# EasyEDA schematic SCH_时钟_2022-10-18.json
TITLE: Sheet_1; REV: 1.0; Date: 2022-10-18; Sheet: 1/1; Drawn By: 小周; Company: Your Company
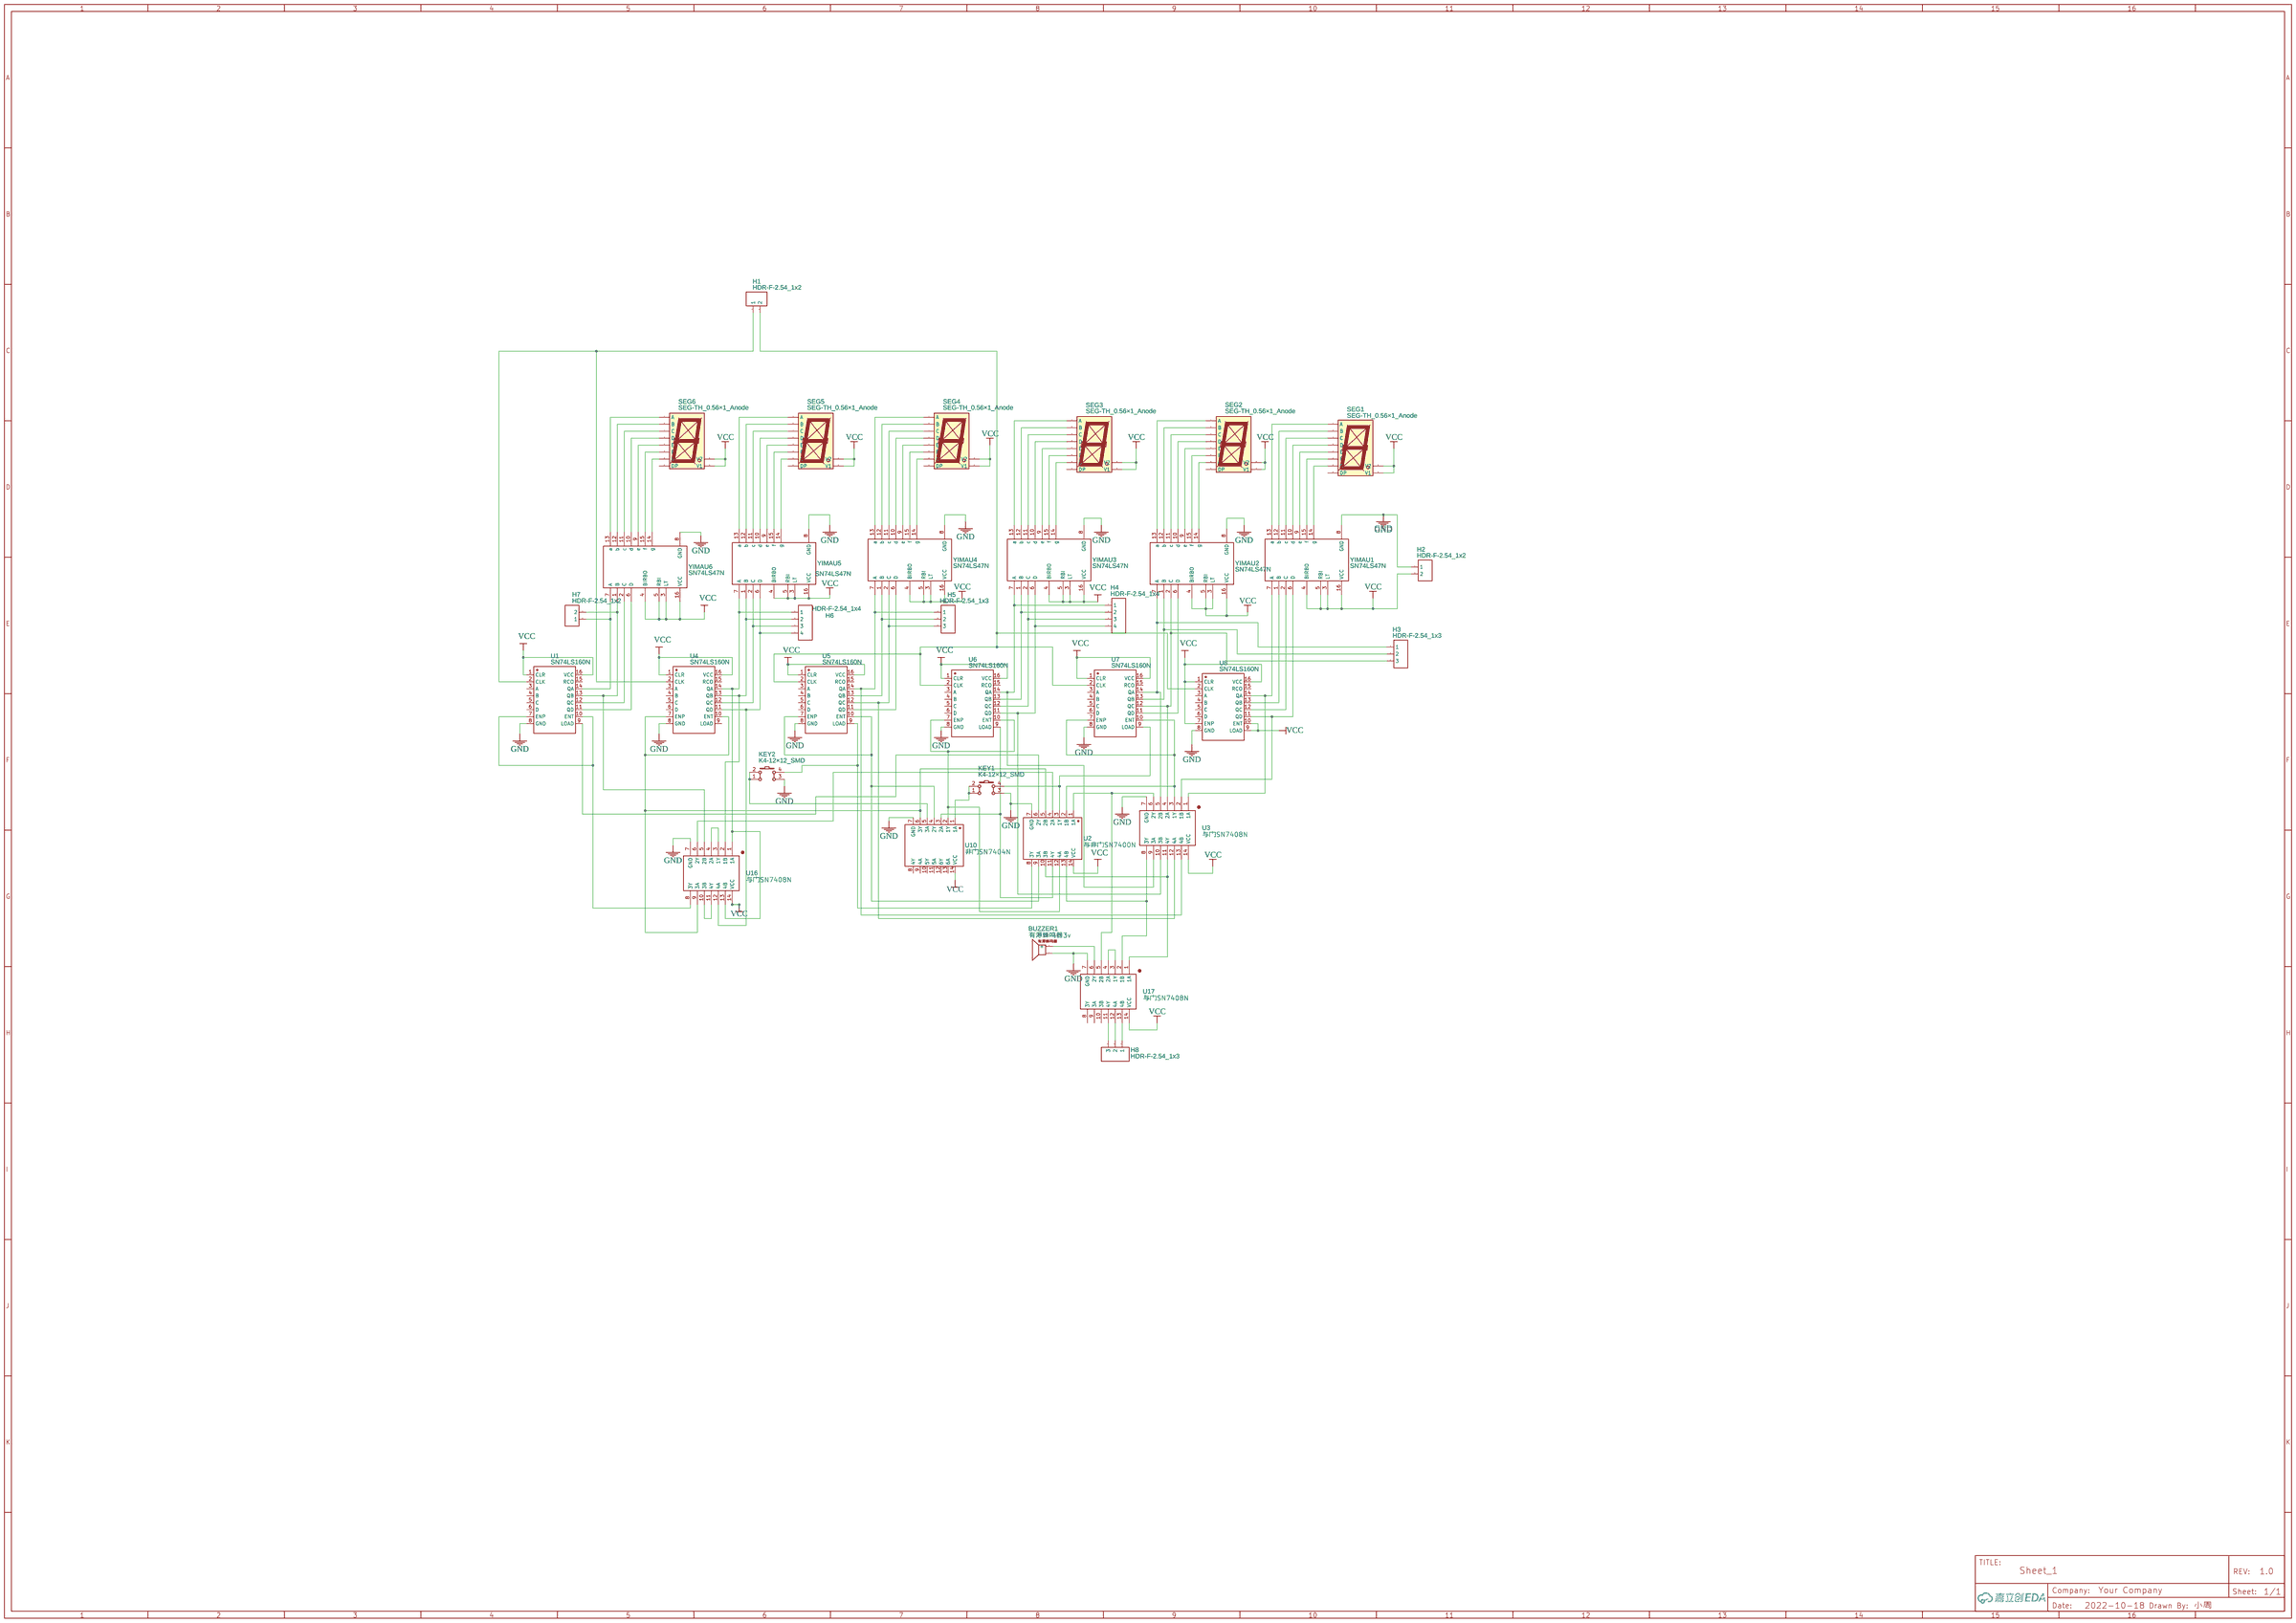
[diagram p0: schematic sheet]

## Parts
BUZZER1  有源蜂鸣器3v  [有源蜂鸣器3V]
H1  HDR-F-2.54_1x2  [HDR-F-2.54_1X2]
H2  HDR-F-2.54_1x2  [HDR-F-2.54_1X2]
H3  HDR-F-2.54_1x3  [HDR-F-2.54_1X3]
H4  HDR-F-2.54_1x4  [HDR-F-2.54_1X4]
H5  HDR-F-2.54_1x3  [HDR-F-2.54_1X3]
H6  HDR-F-2.54_1x4  [HDR-F-2.54_1X4]
H7  HDR-F-2.54_1x2  [HDR-F-2.54_1X2]
H8  HDR-F-2.54_1x3  [HDR-F-2.54_1X3]
KEY1  K4-12×12_SMD  [KEY-SMD_4P-L12.0-W12.0-P5.00-LS15.2]
KEY2  K4-12×12_SMD  [KEY-SMD_4P-L12.0-W12.0-P5.00-LS15.2]
SEG1  SEG-TH_0.56×1_Anode  [LED-SEG-TH_10P-L12.6-W19.0-P2.54-S15.24-BL]
SEG2  SEG-TH_0.56×1_Anode  [LED-SEG-TH_10P-L12.6-W19.0-P2.54-S15.24-BL]
SEG3  SEG-TH_0.56×1_Anode  [LED-SEG-TH_10P-L12.6-W19.0-P2.54-S15.24-BL]
SEG4  SEG-TH_0.56×1_Anode  [LED-SEG-TH_10P-L12.6-W19.0-P2.54-S15.24-BL]
SEG5  SEG-TH_0.56×1_Anode  [LED-SEG-TH_10P-L12.6-W19.0-P2.54-S15.24-BL]
SEG6  SEG-TH_0.56×1_Anode  [LED-SEG-TH_10P-L12.6-W19.0-P2.54-S15.24-BL]
U1  SN74LS160N  [DIP-16]
U2  与非门SN7400N  [DIP14]
U3  与门SN7408N  [DIP14]
U4  SN74LS160N  [DIP-16]
U5  SN74LS160N  [DIP-16]
U6  SN74LS160N  [DIP-16]
U7  SN74LS160N  [DIP-16]
U8  SN74LS160N  [DIP-16]
U10  非门SN7404N  [DIP14]
U16  与门SN7408N  [DIP14]
U17  与门SN7408N  [DIP14]
YIMAU1  SN74LS47N  [DIP-16]
YIMAU2  SN74LS47N  [DIP-16]
YIMAU3  SN74LS47N  [DIP-16]
YIMAU4  SN74LS47N  [DIP-16]
YIMAU5  SN74LS47N  [DIP-16]
YIMAU6  SN74LS47N  [DIP-16]

## Library data of the parts
BUZZER1 = 有源蜂鸣器3v: Supplier: LCSC; Manufacturer: HNDZ; Manufacturer Part: TMB12A12; Supplier Part: C96079; Contributor: yibeikele
H1 H2 H7 = HDR-F-2.54_1x2: Supplier Part: C49661; Supplier: LCSC; Contributor: LCEDA_Lib
H3 H5 H8 = HDR-F-2.54_1x3: Supplier Part: C146690; Supplier: LCSC; Contributor: LCEDA_Lib
H4 H6 = HDR-F-2.54_1x4: Supplier Part: C225501; Supplier: LCSC; Contributor: LCEDA_Lib
KEY1 KEY2 = K4-12×12_SMD: Supplier Part: C136697; Supplier: LCSC; Manufacturer: 韩国韩荣; Manufacturer Part: K2-1103SP-E4SW-04; Contributor: LCEDA_Lib
SEG1-SEG6 = SEG-TH_0.56×1_Anode: Manufacturer: 志浩; Supplier Part: C8092; Supplier: LCSC; Contributor: LCEDA_01
U1 U4-U8 = SN74LS160N: Supplier: LCSC; Supplier Part: C113834; Manufacturer: YAGEO; Manufacturer Part: CC0805JRNPO9BN821; Contributor: LCSC
U2 = SN7400N: Contributor: sky1001
U3 U16 U17 = SN7408N: Contributor: cdea
U10 = SN7404N
YIMAU1-YIMAU6 = -: Supplier: LCSC; Manufacturer: TI; Contributor: LCSC; Supplier Part: C129379

## Nets
GND: BUZZER1.- H2.1 KEY1.3 KEY2.3 U1.8(GND) U2.7(GND) U3.7(GND) U4.8(GND) U5.8(GND) U6.8(GND) U7.8(GND) U8.8(GND) U10.7(GND) U16.7(GND) U17.7(GND) YIMAU1.8(GND) YIMAU2.8(GND) YIMAU3.8(GND) YIMAU4.8(GND) YIMAU5.8(GND) YIMAU6.8(GND)
VCC: H2.2 SEG1.3(V1) SEG1.8(V2) SEG2.3(V1) SEG2.8(V2) SEG3.3(V1) SEG3.8(V2) SEG4.3(V1) SEG4.8(V2) SEG5.3(V1) SEG5.8(V2) SEG6.3(V1) SEG6.8(V2) U1.1(CLR) U1.16(VCC) U2.14(VCC) U3.14(VCC) U4.1(CLR) U4.16(VCC) U5.1(CLR) U5.16(VCC) U6.1(CLR) U6.16(VCC) U7.1(CLR) U7.16(VCC) U8.1(CLR) U8.7(ENP) U8.9(LOAD) U8.10(ENT) U8.16(VCC) U10.14(VCC) U16.14(VCC) U17.14(VCC) YIMAU1.3(LT) YIMAU1.4(BIRBO) YIMAU1.5(RBI) YIMAU1.16(VCC) YIMAU2.3(LT) YIMAU2.4(BIRBO) YIMAU2.5(RBI) YIMAU2.16(VCC) YIMAU3.3(LT) YIMAU3.4(BIRBO) YIMAU3.5(RBI) YIMAU3.16(VCC) YIMAU4.3(LT) YIMAU4.4(BIRBO) YIMAU4.5(RBI) YIMAU4.16(VCC) YIMAU5.3(LT) YIMAU5.4(BIRBO) YIMAU5.5(RBI) YIMAU5.16(VCC) YIMAU6.3(LT) YIMAU6.4(BIRBO) YIMAU6.5(RBI) YIMAU6.16(VCC)
Net-(BUZZER1-+): BUZZER1.+ U17.6(2Y)
Net-(H1-1): H1.1 U1.2(CLK) U4.2(CLK)
Net-(H1-2): H1.2 U5.2(CLK) U6.2(CLK) U7.2(CLK) U8.2(CLK)
Net-(H3-1): H3.1 U3.5(2B) U7.14(QA) YIMAU2.7(A)
Net-(H3-2): H3.2 U7.13(QB) YIMAU2.1(B)
Net-(H3-3): H3.3 U3.4(2A) U7.12(QC) YIMAU2.2(C)
Net-(H4-1): H4.1 U3.9(3A) U6.14(QA) YIMAU3.7(A)
Net-(H4-2): H4.2 U6.13(QB) YIMAU3.1(B)
Net-(H4-3): H4.3 U6.12(QC) YIMAU3.2(C)
Net-(H4-4): H4.4 U3.10(3B) U6.11(QD) YIMAU3.6(D)
Net-(H5-1): H5.1 U3.13(4B) U5.14(QA) YIMAU4.7(A)
Net-(H5-2): H5.2 U5.13(QB) YIMAU4.1(B)
Net-(H5-3): H5.3 U3.12(4A) U5.12(QC) YIMAU4.2(C)
Net-(H6-1): H6.1 U4.14(QA) U16.1(1A) U16.13(4B) YIMAU5.7(A)
Net-(H6-2): H6.2 U4.13(QB) U16.2(1B) YIMAU5.1(B)
Net-(H6-3): H6.3 U4.12(QC) YIMAU5.2(C)
Net-(H6-4): H6.4 U4.11(QD) U16.12(4A) YIMAU5.6(D)
Net-(H7-1): H7.1 U1.14(QA) YIMAU6.7(A)
Net-(H7-2): H7.2 U1.13(QB) U16.5(2B) YIMAU6.1(B)
Net-(H8-1): H8.1 U17.13(4B)
Net-(H8-2): H8.2 U17.12(4A)
Net-(H8-3): H8.3 U17.11(4Y)
Net-(KEY1-1): KEY1.1 KEY1.2 U10.1(1A)
Net-(KEY1-4): KEY1.4 U2.3(1Y) U7.9(LOAD)
Net-(KEY2-1): KEY2.1 KEY2.2 U10.5(3A)
Net-(KEY2-4): KEY2.4 U2.8(3Y) U5.9(LOAD)
Net-(SEG1-1): SEG1.1(E) YIMAU1.9(e)
Net-(SEG1-2): SEG1.2(D) YIMAU1.10(d)
Net-(SEG1-4): SEG1.4(C) YIMAU1.11(c)
Net-(SEG1-6): SEG1.6(B) YIMAU1.12(b)
Net-(SEG1-7): SEG1.7(A) YIMAU1.13(a)
Net-(SEG1-9): SEG1.9(F) YIMAU1.15(f)
Net-(SEG1-10): SEG1.10(G) YIMAU1.14(g)
Net-(SEG2-1): SEG2.1(E) YIMAU2.9(e)
Net-(SEG2-2): SEG2.2(D) YIMAU2.10(d)
Net-(SEG2-4): SEG2.4(C) YIMAU2.11(c)
Net-(SEG2-6): SEG2.6(B) YIMAU2.12(b)
Net-(SEG2-7): SEG2.7(A) YIMAU2.13(a)
Net-(SEG2-9): SEG2.9(F) YIMAU2.15(f)
Net-(SEG2-10): SEG2.10(G) YIMAU2.14(g)
Net-(SEG3-1): SEG3.1(E) YIMAU3.9(e)
Net-(SEG3-2): SEG3.2(D) YIMAU3.10(d)
Net-(SEG3-4): SEG3.4(C) YIMAU3.11(c)
Net-(SEG3-6): SEG3.6(B) YIMAU3.12(b)
Net-(SEG3-7): SEG3.7(A) YIMAU3.13(a)
Net-(SEG3-9): SEG3.9(F) YIMAU3.15(f)
Net-(SEG3-10): SEG3.10(G) YIMAU3.14(g)
Net-(SEG4-1): SEG4.1(E) YIMAU4.9(e)
Net-(SEG4-2): SEG4.2(D) YIMAU4.10(d)
Net-(SEG4-4): SEG4.4(C) YIMAU4.11(c)
Net-(SEG4-6): SEG4.6(B) YIMAU4.12(b)
Net-(SEG4-7): SEG4.7(A) YIMAU4.13(a)
Net-(SEG4-9): SEG4.9(F) YIMAU4.15(f)
Net-(SEG4-10): SEG4.10(G) YIMAU4.14(g)
Net-(SEG5-1): SEG5.1(E) YIMAU5.9(e)
Net-(SEG5-2): SEG5.2(D) YIMAU5.10(d)
Net-(SEG5-4): SEG5.4(C) YIMAU5.11(c)
Net-(SEG5-6): SEG5.6(B) YIMAU5.12(b)
Net-(SEG5-7): SEG5.7(A) YIMAU5.13(a)
Net-(SEG5-9): SEG5.9(F) YIMAU5.15(f)
Net-(SEG5-10): SEG5.10(G) YIMAU5.14(g)
Net-(SEG6-1): SEG6.1(E) YIMAU6.9(e)
Net-(SEG6-2): SEG6.2(D) YIMAU6.10(d)
Net-(SEG6-4): SEG6.4(C) YIMAU6.11(c)
Net-(SEG6-6): SEG6.6(B) YIMAU6.12(b)
Net-(SEG6-7): SEG6.7(A) YIMAU6.13(a)
Net-(SEG6-9): SEG6.9(F) YIMAU6.15(f)
Net-(SEG6-10): SEG6.10(G) YIMAU6.14(g)
Net-(U1-7): U1.7(ENP) U1.10(ENT) U16.8(3Y)
Net-(U1-9): U1.9(LOAD) U2.6(2Y)
Net-(U1-11): U1.11(QD) YIMAU6.6(D)
Net-(U1-12): U1.12(QC) YIMAU6.2(C)
Net-(U2-1): U2.1(1A) U3.6(2Y) U17.5(2B)
Net-(U2-2): U2.2(1B) U3.3(1Y) U7.7(ENP) U7.10(ENT)
Net-(U2-4): U2.4(2A) U16.6(2Y)
Net-(U2-5): U2.5(2B) U4.7(ENP) U4.10(ENT) U10.6(3Y) U16.9(3A)
Net-(U2-9): U2.9(3A) U5.7(ENP) U5.10(ENT) U10.4(2Y)
Net-(U2-10): U2.10(3B) U3.11(4Y) U17.1(1A)
Net-(U2-11): U2.11(4Y) U6.9(LOAD) U10.3(2A)
Net-(U2-12): U2.12(4A) U6.7(ENP) U6.10(ENT) U10.2(1Y)
Net-(U2-13): U2.13(4B) U3.8(3Y) U17.2(1B)
Net-(U3-1): U3.1(1A) U8.14(QA) YIMAU1.7(A)
Net-(U3-2): U3.2(1B) U8.11(QD) YIMAU1.6(D)
Net-(U5-11): U5.11(QD) YIMAU4.6(D)
Net-(U7-11): U7.11(QD) YIMAU2.6(D)
Net-(U8-12): U8.12(QC) YIMAU1.2(C)
Net-(U8-13): U8.13(QB) YIMAU1.1(B)
Net-(U16-3): U16.3(1Y) U16.4(2A)
Net-(U16-10): U16.10(3B) U16.11(4Y)
Net-(U17-3): U17.3(1Y) U17.4(2A)

Not connected (* = marked no-connect by the designer): SEG1 5(DP); SEG2 5(DP); SEG3 5(DP); SEG4 5(DP); SEG5 5(DP); SEG6 5(DP); U1 3(A) 4(B) 5(C) 6(D) 15(RCO); U4 3(A) 4(B) 5(C) 6(D) 9(LOAD) 15(RCO); U5 3(A) 4(B) 5(C) 6(D) 15(RCO); U6 3(A) 4(B) 5(C) 6(D) 15(RCO); U7 3(A) 4(B) 5(C) 6(D) 15(RCO); U8 3(A) 4(B) 5(C) 6(D) 15(RCO); U10 8(4Y) 9(4A) 10(5Y) 11(5A) 12(6Y) 13(6A); U17 8(3Y) 9(3A) 10(3B)

## Notes on the sheet
- GND
